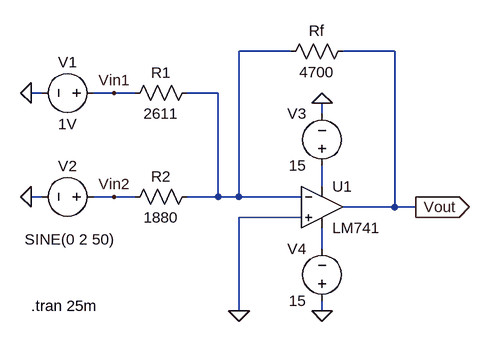
[diagram p0: schematic lab5_4.asc]
lab5_4.asc, the LTspice schematic file:
Version 4
SHEET 1 880 680
WIRE 160 -48 80 -48
WIRE 320 -48 240 -48
WIRE -224 16 -240 16
WIRE -112 16 -144 16
WIRE -80 16 -112 16
WIRE 48 16 0 16
WIRE 208 48 208 32
WIRE 208 160 208 128
WIRE -224 176 -240 176
WIRE -112 176 -144 176
WIRE -80 176 -112 176
WIRE 48 176 48 16
WIRE 48 176 0 176
WIRE 80 176 80 -48
WIRE 80 176 48 176
WIRE 176 176 80 176
WIRE 320 192 320 -48
WIRE 320 192 240 192
WIRE 352 192 320 192
WIRE 176 208 80 208
WIRE 208 256 208 224
WIRE 80 352 80 208
WIRE 208 352 208 336
FLAG 208 352 0
FLAG 208 32 0
FLAG 80 352 0
FLAG -240 16 0
FLAG -240 176 0
FLAG 352 192 Vout
IOPIN 352 192 Out
FLAG -112 16 Vin1
FLAG -112 176 Vin2
SYMBOL OpAmps\\LM741 208 128 R0
SYMATTR InstName U1
SYMBOL voltage 208 352 R180
WINDOW 0 24 96 Left 2
WINDOW 3 24 16 Left 2
WINDOW 123 0 0 Left 0
WINDOW 39 0 0 Left 0
SYMATTR InstName V4
SYMATTR Value 15
SYMBOL voltage 208 144 R180
WINDOW 0 24 96 Left 2
WINDOW 3 24 16 Left 2
WINDOW 123 0 0 Left 0
WINDOW 39 0 0 Left 0
SYMATTR InstName V3
SYMATTR Value 15
SYMBOL res 256 -64 R90
WINDOW 0 0 56 VBottom 2
WINDOW 3 32 56 VTop 2
SYMATTR InstName Rf
SYMATTR Value 4700
SYMBOL res 16 0 R90
WINDOW 0 0 56 VBottom 2
WINDOW 3 32 56 VTop 2
SYMATTR InstName R1
SYMATTR Value 2611
SYMBOL res 16 160 R90
WINDOW 0 0 56 VBottom 2
WINDOW 3 32 56 VTop 2
SYMATTR InstName R2
SYMATTR Value 1880
SYMBOL voltage -128 16 R90
WINDOW 0 -32 56 VBottom 2
WINDOW 3 32 56 VTop 2
WINDOW 123 0 0 Left 0
WINDOW 39 0 0 Left 0
SYMATTR InstName V1
SYMATTR Value 1V
SYMBOL voltage -128 176 R90
WINDOW 0 -32 56 VBottom 2
WINDOW 3 50 52 VTop 2
WINDOW 123 0 0 Left 0
WINDOW 39 0 0 Left 0
SYMATTR InstName V2
SYMATTR Value SINE(0 2 50)
TEXT -240 344 Left 2 !.tran 25m

The netlist it stands for:
* lab5_4.asc
XU1 0 N001 N002 N003 Vout LM741  ; pins In+ In- V+ V- OUT
V4 0 N003 15
V3 N002 0 15
Rf Vout N001 4700
R1 N001 Vin1 2611
R2 N001 Vin2 1880
V1 Vin1 0 1V
V2 Vin2 0 SINE(0 2 50)
.tran 25m
.lib LM741.lib
.backanno
.end